# EAGLE schematic tester (EAGLE 7.5.0)

## Sheet 1 of 3: BUS
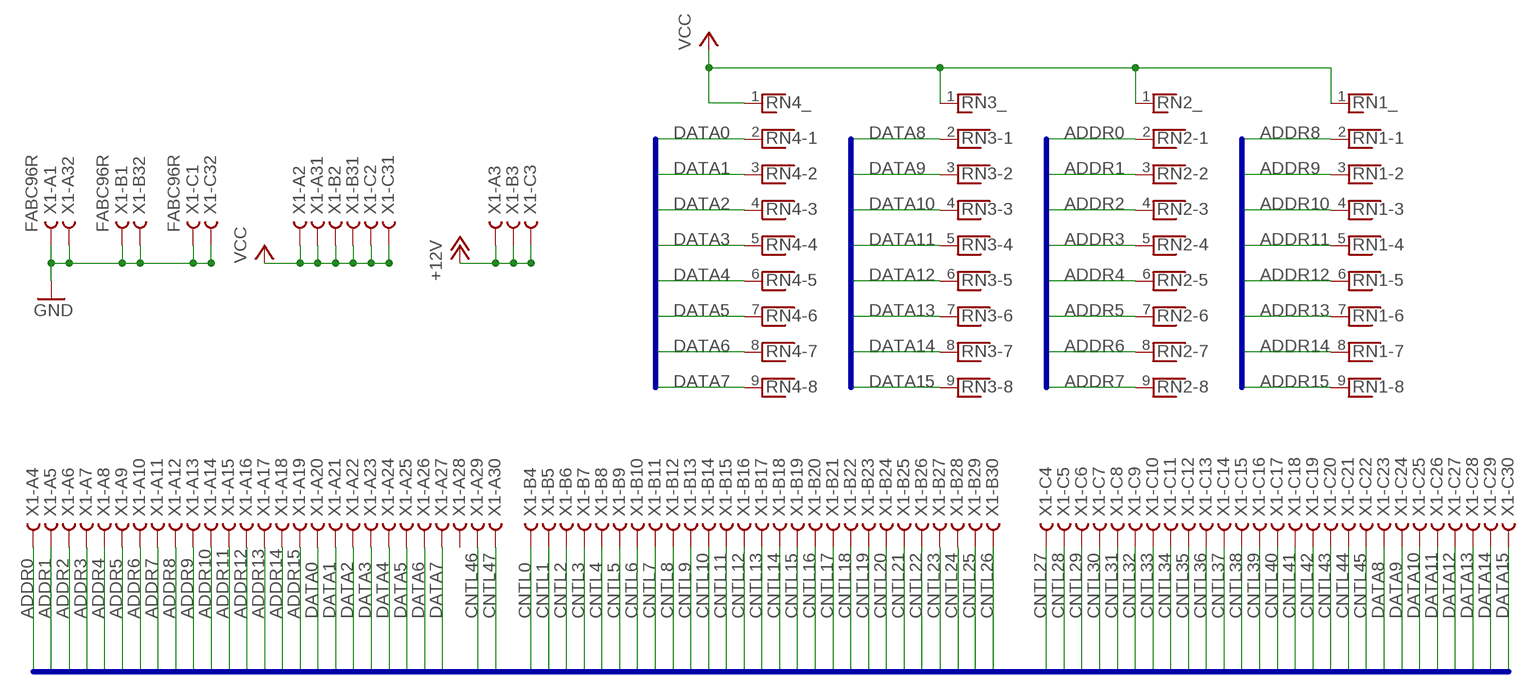
[diagram p0: schematic, sheet 1]

### Parts
RN1  RNX8  [RN-9]
RN2  RNX8  [RN-9]
RN3  RNX8  [RN-9]
RN4  RNX8  [RN-9]
X1  FABC96R  [FABC96R]

### Nets
+12V: X1.A3 X1.B3 X1.C3
ADDR0: RN2.2 X1.A4 ; also sheet 2
ADDR1: RN2.3 X1.A5 ; also sheet 2
ADDR2: RN2.4 X1.A6 ; also sheet 2
ADDR3: RN2.5 X1.A7 ; also sheet 2
ADDR4: RN2.6 X1.A8 ; also sheet 2
ADDR5: RN2.7 X1.A9 ; also sheet 2
ADDR6: RN2.8 X1.A10 ; also sheet 2
ADDR7: RN2.9 X1.A11 ; also sheet 2
ADDR8: RN1.2 X1.A12 ; also sheet 2
ADDR9: RN1.3 X1.A13 ; also sheet 2
ADDR10: RN1.4 X1.A14 ; also sheet 2
ADDR11: RN1.5 X1.A15 ; also sheet 2
ADDR12: RN1.6 X1.A16 ; also sheet 2
ADDR13: RN1.7 X1.A17 ; also sheet 2
ADDR14: RN1.8 X1.A18 ; also sheet 2
ADDR15: RN1.9 X1.A19 ; also sheet 2
CNTL0: X1.B4 ; also sheet 2
CNTL1: X1.B5 ; also sheet 2
CNTL2: X1.B6 ; also sheet 2
CNTL3: X1.B7 ; also sheet 2
CNTL4: X1.B8 ; also sheet 2
CNTL5: X1.B9 ; also sheet 2
CNTL6: X1.B10 ; also sheet 2
CNTL7: X1.B11 ; also sheet 2
CNTL8: X1.B12 ; also sheet 2
CNTL9: X1.B13 ; also sheet 2
CNTL10: X1.B14 ; also sheet 2
CNTL11: X1.B15 ; also sheet 2
CNTL12: X1.B16 ; also sheet 2
CNTL13: X1.B17 ; also sheet 2
CNTL14: X1.B18 ; also sheet 2
CNTL15: X1.B19 ; also sheet 2
CNTL16: X1.B20 ; also sheet 2
CNTL17: X1.B21 ; also sheet 2
CNTL18: X1.B22 ; also sheet 2
CNTL19: X1.B23 ; also sheet 2
CNTL20: X1.B24 ; also sheet 2
CNTL21: X1.B25 ; also sheet 2
CNTL22: X1.B26 ; also sheet 2
CNTL23: X1.B27 ; also sheet 2
CNTL24: X1.B28 ; also sheet 2
CNTL25: X1.B29 ; also sheet 2
CNTL26: X1.B30 ; also sheet 2
CNTL27: X1.C4 ; also sheet 2
CNTL28: X1.C5 ; also sheet 2
CNTL29: X1.C6 ; also sheet 2
CNTL30: X1.C7 ; also sheet 2
CNTL31: X1.C8 ; also sheet 2
CNTL32: X1.C9 ; also sheet 2
CNTL33: X1.C10 ; also sheet 2
CNTL34: X1.C11 ; also sheet 2
CNTL35: X1.C12 ; also sheet 2
CNTL36: X1.C13 ; also sheet 2
CNTL37: X1.C14 ; also sheet 2
CNTL38: X1.C15 ; also sheet 2
CNTL39: X1.C16 ; also sheet 2
CNTL40: X1.C17 ; also sheet 2
CNTL41: X1.C18 ; also sheet 2
CNTL42: X1.C19 ; also sheet 2
CNTL43: X1.C20 ; also sheet 2
CNTL44: X1.C21 ; also sheet 2
CNTL45: X1.C22 ; also sheet 2
CNTL46: X1.A29 ; also sheet 2
CNTL47: X1.A30 ; also sheet 2
DATA0: RN4.2 X1.A20 ; also sheet 2
DATA1: RN4.3 X1.A21 ; also sheet 2
DATA2: RN4.4 X1.A22 ; also sheet 2
DATA3: RN4.5 X1.A23 ; also sheet 2
DATA4: RN4.6 X1.A24 ; also sheet 2
DATA5: RN4.7 X1.A25 ; also sheet 2
DATA6: RN4.8 X1.A26 ; also sheet 2
DATA7: RN4.9 X1.A27 ; also sheet 2
DATA8: RN3.2 X1.C23 ; also sheet 2
DATA9: RN3.3 X1.C24 ; also sheet 2
DATA10: RN3.4 X1.C25 ; also sheet 2
DATA11: RN3.5 X1.C26 ; also sheet 2
DATA12: RN3.6 X1.C27 ; also sheet 2
DATA13: RN3.7 X1.C28 ; also sheet 2
DATA14: RN3.8 X1.C29 ; also sheet 2
DATA15: RN3.9 X1.C30 ; also sheet 2
GND: X1.A1 X1.A32 X1.B1 X1.B32 X1.C1 X1.C32 ; also sheet 2,3
VCC: RN1.1 RN2.1 RN3.1 RN4.1 X1.A2 X1.A31 X1.B2 X1.B31 X1.C2 X1.C31 ; also sheet 2,3
Unconnected: X1.A28

### Buses
ADDR[0..15],DATA[0..15],CNTL[0..48]

## Sheet 2 of 3: I/O
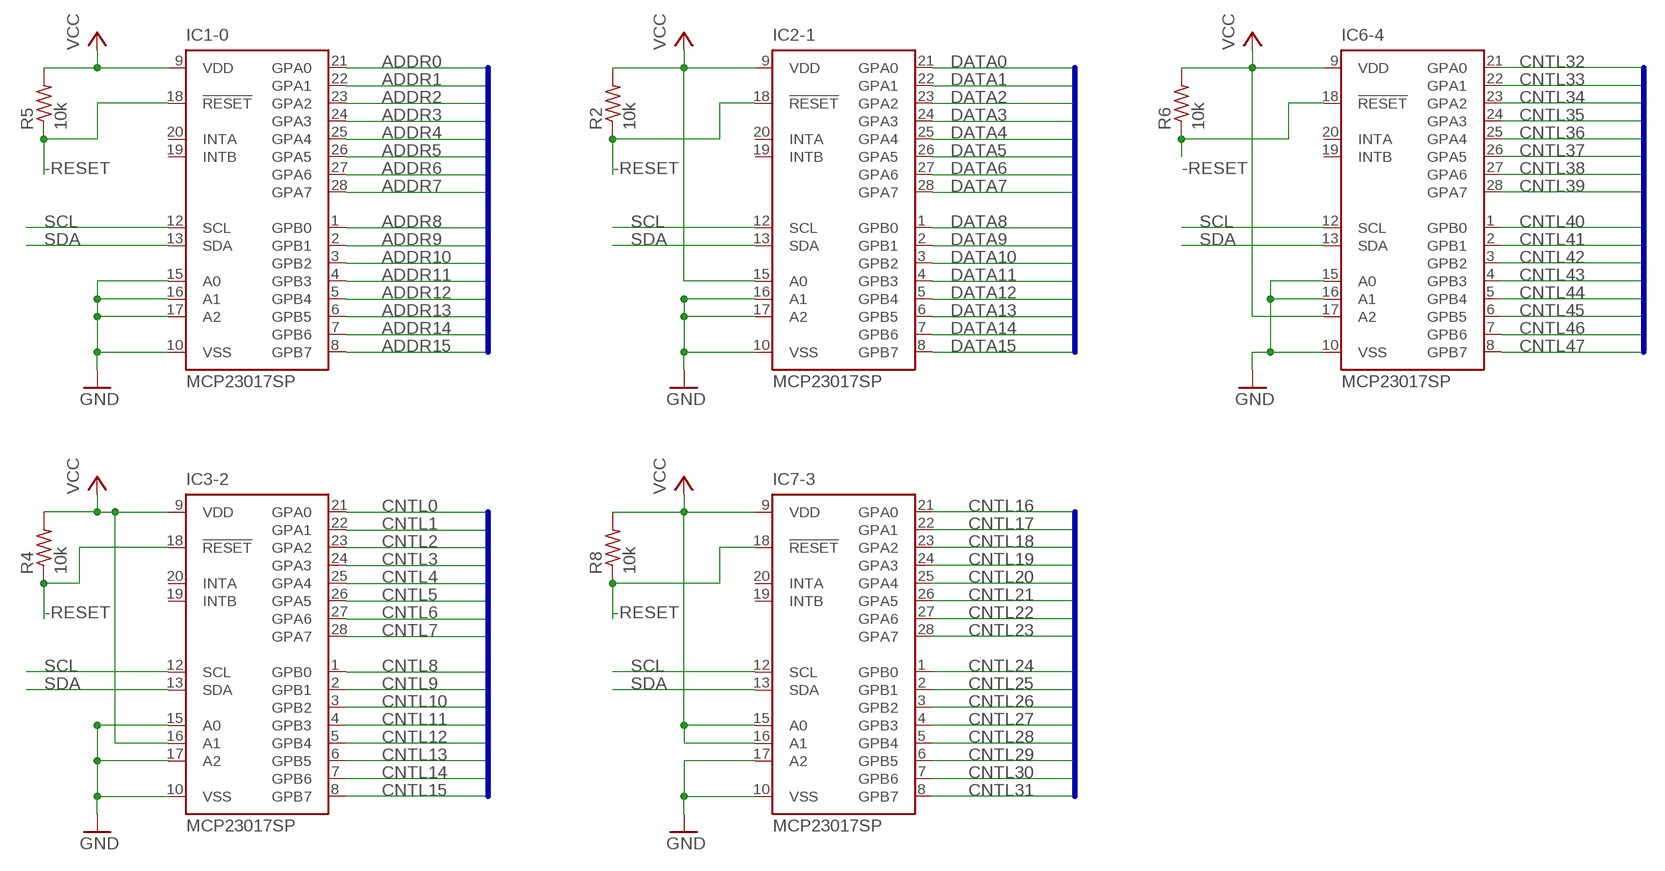
[diagram p1: schematic, sheet 2]

### Parts
IC1-0  MCP23017SP  [DIL28-3]
IC2-1  MCP23017SP  [DIL28-3]
IC3-2  MCP23017SP  [DIL28-3]
IC6-4  MCP23017SP  [DIL28-3]
IC7-3  MCP23017SP  [DIL28-3]
R2  10k  R-US_0207/10  [0207/10]
R4  10k  R-US_0207/10  [0207/10]
R5  10k  R-US_0207/10  [0207/10]
R6  10k  R-US_0207/10  [0207/10]
R8  10k  R-US_0207/10  [0207/10]

### Nets
-RESET: IC1-0.18(!RESET) IC2-1.18(!RESET) IC3-2.18(!RESET) IC6-4.18(!RESET) IC7-3.18(!RESET) R2.1 R4.1 R5.1 R6.1 R8.1 ; also sheet 3
ADDR0: IC1-0.21(GPA0) ; also sheet 1
ADDR1: IC1-0.22(GPA1) ; also sheet 1
ADDR2: IC1-0.23(GPA2) ; also sheet 1
ADDR3: IC1-0.24(GPA3) ; also sheet 1
ADDR4: IC1-0.25(GPA4) ; also sheet 1
ADDR5: IC1-0.26(GPA5) ; also sheet 1
ADDR6: IC1-0.27(GPA6) ; also sheet 1
ADDR7: IC1-0.28(GPA7) ; also sheet 1
ADDR8: IC1-0.1(GPB0) ; also sheet 1
ADDR9: IC1-0.2(GPB1) ; also sheet 1
ADDR10: IC1-0.3(GPB2) ; also sheet 1
ADDR11: IC1-0.4(GPB3) ; also sheet 1
ADDR12: IC1-0.5(GPB4) ; also sheet 1
ADDR13: IC1-0.6(GPB5) ; also sheet 1
ADDR14: IC1-0.7(GPB6) ; also sheet 1
ADDR15: IC1-0.8(GPB7) ; also sheet 1
CNTL0: IC3-2.21(GPA0) ; also sheet 1
CNTL1: IC3-2.22(GPA1) ; also sheet 1
CNTL2: IC3-2.23(GPA2) ; also sheet 1
CNTL3: IC3-2.24(GPA3) ; also sheet 1
CNTL4: IC3-2.25(GPA4) ; also sheet 1
CNTL5: IC3-2.26(GPA5) ; also sheet 1
CNTL6: IC3-2.27(GPA6) ; also sheet 1
CNTL7: IC3-2.28(GPA7) ; also sheet 1
CNTL8: IC3-2.1(GPB0) ; also sheet 1
CNTL9: IC3-2.2(GPB1) ; also sheet 1
CNTL10: IC3-2.3(GPB2) ; also sheet 1
CNTL11: IC3-2.4(GPB3) ; also sheet 1
CNTL12: IC3-2.5(GPB4) ; also sheet 1
CNTL13: IC3-2.6(GPB5) ; also sheet 1
CNTL14: IC3-2.7(GPB6) ; also sheet 1
CNTL15: IC3-2.8(GPB7) ; also sheet 1
CNTL16: IC7-3.21(GPA0) ; also sheet 1
CNTL17: IC7-3.22(GPA1) ; also sheet 1
CNTL18: IC7-3.23(GPA2) ; also sheet 1
CNTL19: IC7-3.24(GPA3) ; also sheet 1
CNTL20: IC7-3.25(GPA4) ; also sheet 1
CNTL21: IC7-3.26(GPA5) ; also sheet 1
CNTL22: IC7-3.27(GPA6) ; also sheet 1
CNTL23: IC7-3.28(GPA7) ; also sheet 1
CNTL24: IC7-3.1(GPB0) ; also sheet 1
CNTL25: IC7-3.2(GPB1) ; also sheet 1
CNTL26: IC7-3.3(GPB2) ; also sheet 1
CNTL27: IC7-3.4(GPB3) ; also sheet 1
CNTL28: IC7-3.5(GPB4) ; also sheet 1
CNTL29: IC7-3.6(GPB5) ; also sheet 1
CNTL30: IC7-3.7(GPB6) ; also sheet 1
CNTL31: IC7-3.8(GPB7) ; also sheet 1
CNTL32: IC6-4.21(GPA0) ; also sheet 1
CNTL33: IC6-4.22(GPA1) ; also sheet 1
CNTL34: IC6-4.23(GPA2) ; also sheet 1
CNTL35: IC6-4.24(GPA3) ; also sheet 1
CNTL36: IC6-4.25(GPA4) ; also sheet 1
CNTL37: IC6-4.26(GPA5) ; also sheet 1
CNTL38: IC6-4.27(GPA6) ; also sheet 1
CNTL39: IC6-4.28(GPA7) ; also sheet 1
CNTL40: IC6-4.1(GPB0) ; also sheet 1
CNTL41: IC6-4.2(GPB1) ; also sheet 1
CNTL42: IC6-4.3(GPB2) ; also sheet 1
CNTL43: IC6-4.4(GPB3) ; also sheet 1
CNTL44: IC6-4.5(GPB4) ; also sheet 1
CNTL45: IC6-4.6(GPB5) ; also sheet 1
CNTL46: IC6-4.7(GPB6) ; also sheet 1
CNTL47: IC6-4.8(GPB7) ; also sheet 1
DATA0: IC2-1.21(GPA0) ; also sheet 1
DATA1: IC2-1.22(GPA1) ; also sheet 1
DATA2: IC2-1.23(GPA2) ; also sheet 1
DATA3: IC2-1.24(GPA3) ; also sheet 1
DATA4: IC2-1.25(GPA4) ; also sheet 1
DATA5: IC2-1.26(GPA5) ; also sheet 1
DATA6: IC2-1.27(GPA6) ; also sheet 1
DATA7: IC2-1.28(GPA7) ; also sheet 1
DATA8: IC2-1.1(GPB0) ; also sheet 1
DATA9: IC2-1.2(GPB1) ; also sheet 1
DATA10: IC2-1.3(GPB2) ; also sheet 1
DATA11: IC2-1.4(GPB3) ; also sheet 1
DATA12: IC2-1.5(GPB4) ; also sheet 1
DATA13: IC2-1.6(GPB5) ; also sheet 1
DATA14: IC2-1.7(GPB6) ; also sheet 1
DATA15: IC2-1.8(GPB7) ; also sheet 1
GND: IC1-0.10(VSS) IC1-0.15(A0) IC1-0.16(A1) IC1-0.17(A2) IC2-1.10(VSS) IC2-1.16(A1) IC2-1.17(A2) IC3-2.10(VSS) IC3-2.15(A0) IC3-2.17(A2) IC6-4.10(VSS) IC6-4.15(A0) IC6-4.16(A1) IC7-3.10(VSS) IC7-3.17(A2) ; also sheet 1,3
SCL: IC1-0.12(SCL) IC2-1.12(SCL) IC3-2.12(SCL) IC6-4.12(SCL) IC7-3.12(SCL) ; also sheet 3
SDA: IC1-0.13(SDA) IC2-1.13(SDA) IC3-2.13(SDA) IC6-4.13(SDA) IC7-3.13(SDA) ; also sheet 3
VCC: IC1-0.9(VDD) IC2-1.9(VDD) IC2-1.15(A0) IC3-2.9(VDD) IC3-2.16(A1) IC6-4.9(VDD) IC6-4.17(A2) IC7-3.9(VDD) IC7-3.15(A0) IC7-3.16(A1) R2.2 R4.2 R5.2 R6.2 R8.2 ; also sheet 1,3
Unconnected: IC1-0.19(INTB) IC1-0.20(INTA) IC2-1.19(INTB) IC2-1.20(INTA) IC3-2.19(INTB) IC3-2.20(INTA) IC6-4.19(INTB) IC6-4.20(INTA) IC7-3.19(INTB) IC7-3.20(INTA)

### Buses
ADDR[0..15]
DATA[0..15]
CNTL[0..53]

## Sheet 3 of 3: CPU
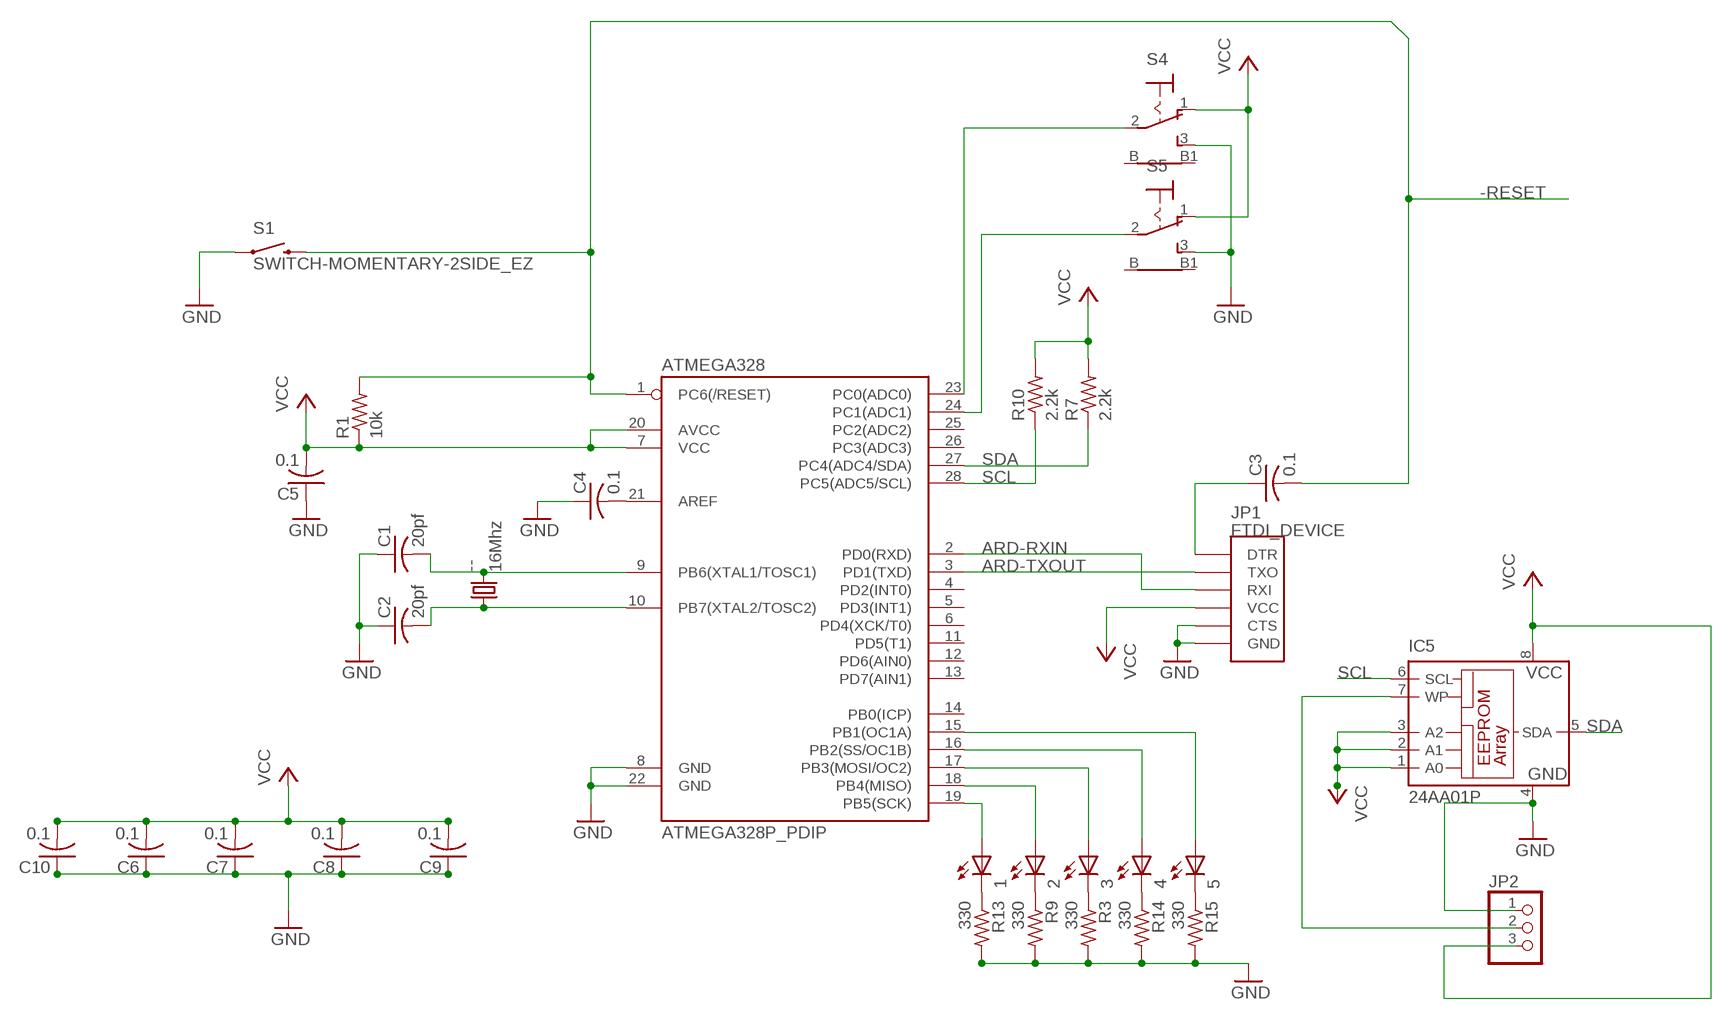
[diagram p2: schematic, sheet 3]

### Parts
1  LED5MM  [LED5MM]
2  LED5MM  [LED5MM]
3  LED5MM  [LED5MM]
4  LED5MM  [LED5MM]
5  LED5MM  [LED5MM]
--  16Mhz  CRYSTALHC49S  [HC49/S]
ATMEGA328  ATMEGA328P_PDIP  [DIL28-3]
C1  20pf  C-US025-024X044  [C025-024X044]
C2  20pf  C-US025-024X044  [C025-024X044]
C3  0.1  C-US025-024X044  [C025-024X044]
C4  0.1  C-US025-024X044  [C025-024X044]
C5  0.1  C-US025-024X044  [C025-024X044]
C6  0.1  C-US025-024X044  [C025-024X044]
C7  0.1  C-US025-024X044  [C025-024X044]
C8  0.1  C-US025-024X044  [C025-024X044]
C9  0.1  C-US025-024X044  [C025-024X044]
C10  0.1  C-US025-024X044  [C025-024X044]
IC5  24AA01P  [DIL8]
JP1  FTDI_DEVICE  [FTDI_DEVICE_SIDE]
JP2  PINHD-1X3  [1X03]
R1  10k  R-US_0207/10  [0207/10]
R3  330  R-US_0207/10  [0207/10]
R7  2.2k  R-US_0207/10  [0207/10]
R9  330  R-US_0207/10  [0207/10]
R10  2.2k  R-US_0207/10  [0207/10]
R13  330  R-US_0207/10  [0207/10]
R14  330  R-US_0207/10  [0207/10]
R15  330  R-US_0207/10  [0207/10]
S1  SWITCH-MOMENTARY-2SIDE_EZ  [TACTILE-PTH-SIDEEZ]
S4  9070-1W  [9070-1W]
S5  9070-1W  [9070-1W]

### Nets
-RESET: ATMEGA328.1(PC6(/RESET)) C3.2 R1.2 S1.2 ; also sheet 2
ARD-RXIN: ATMEGA328.2(PD0(RXD)) JP1.P$3(RXI)
ARD-TXOUT: ATMEGA328.3(PD1(TXD)) JP1.P$2(TXO)
GND: ATMEGA328.8(GND) ATMEGA328.22(GND) C1.1 C2.1 C4.1 C5.1 C6.1 C7.1 C8.1 C9.1 C10.1 IC5.4(GND) JP1.P$5(CTS) JP1.P$6(GND) JP2.1 R3.2 R9.2 R13.2 R14.2 R15.2 S1.1 S4.3(S) S5.3(S) ; also sheet 1,2
N$1: 1.A ATMEGA328.19(PB5(SCK))
N$2: IC5.7(WP) JP2.2
N$3: --.2 ATMEGA328.9(PB6(XTAL1/TOSC1)) C1.2
N$4: --.1 ATMEGA328.10(PB7(XTAL2/TOSC2)) C2.2
N$6: 2.A ATMEGA328.18(PB4(MISO))
N$7: 3.A ATMEGA328.17(PB3(MOSI/OC2))
N$8: 4.A ATMEGA328.16(PB2(SS/OC1B))
N$9: C3.1 JP1.P$1(DTR)
N$10: 5.A ATMEGA328.15(PB1(OC1A))
N$11: 2.K(C) R9.1
N$12: 1.K(C) R13.1
N$13: 3.K(C) R3.1
N$14: ATMEGA328.21(AREF) C4.2
N$15: 4.K(C) R14.1
N$16: 5.K(C) R15.1
N$18: ATMEGA328.23(PC0(ADC0)) S4.2(P)
N$19: ATMEGA328.24(PC1(ADC1)) S5.2(P)
SCL: ATMEGA328.28(PC5(ADC5/SCL)) IC5.6(SCL) R10.1 ; also sheet 2
SDA: ATMEGA328.27(PC4(ADC4/SDA)) IC5.5(SDA) R7.1 ; also sheet 2
VCC: ATMEGA328.7(VCC) ATMEGA328.20(AVCC) C5.2 C6.2 C7.2 C8.2 C9.2 C10.2 IC5.1(A0) IC5.2(A1) IC5.3(A2) IC5.8(VCC) JP1.P$4(VCC) JP2.3 R1.1 R7.2 R10.2 S4.1(O) S5.1(O) ; also sheet 1,2
Unconnected: ATMEGA328.4(PD2(INT0)) ATMEGA328.5(PD3(INT1)) ATMEGA328.6(PD4(XCK/T0)) ATMEGA328.11(PD5(T1)) ATMEGA328.12(PD6(AIN0)) ATMEGA328.13(PD7(AIN1)) ATMEGA328.14(PB0(ICP)) ATMEGA328.25(PC2(ADC2)) ATMEGA328.26(PC3(ADC3)) S4.B S4.B1 S5.B S5.B1

## Library data of the parts
1-5 = led:LED: LED OSRAM: - CHIPLED LG R971, LG N971, LY N971, LG Q971, LY Q971, LO R971, LY R971 LH N974, LH R974 LS Q976, LO Q976, LY Q976 LO Q996 - Hyper CHIPLED LW Q18S LB Q993, LB Q99A, LB R99A - SideLED LS A670, LO A670, LY A670, LG A670, LP A670 LB A673, LV A673, LT A673, LW A673 LH A674 LY A675 LS A676, LA A676, LO A676, LY A676, LW A676 LS A679, LY A679, LG A679 - Hyper Micro SIDELED® LS Y876, LA Y876, LO Y876, LY Y876 LT Y87S - SmartLED LW L88C, LW L88S LB L89C, LB L89S, LG L890 LS L89K, LO L89K, LY L89K LS L896, LA L896, LO L896, LY L896 - TOPLED LS T670, LO T670, LY T670, LG T670, LP T670 LSG T670, LSP T670, LSY T670, LOP T670, LYG T670 LG T671, LOG T671, LSG T671 LB T673, LV T673, LT T673, LW T673 LH T674 LS T676, LA T676, LO T676, LY T676, LB T676, LH T676, LSB T676, LW T676 LB T67C, LV T67C, LT T67C, LS T67K, LO T67K, LY T67K, LW E67C LS E67B, LA E67B, LO E67B, LY E67B, LB E67C, LV E67C, LT E67C LW T67C LS T679, LY T679, LG T679 LS T770, LO T770, LY T770, LG T770, LP T770 LB T773, LV T773, LT T773, LW T773 LH T774 LS E675, LA E675, LY E675, LS T675 LS T776, LA T776, LO T776, LY T776, LB T776 LHGB T686 LT T68C, LB T68C - Hyper Mini TOPLED® LB M676 - Mini TOPLED Santana® LG M470 LS M47K, LO M47K, LY M47K Source: http://www.osram.convergy.de LUXEON: - LUMILED® LXK2-PW12-R00, LXK2-PW12-S00, LXK2-PW14-U00, LXK2-PW14-V00 LXK2-PM12-R00, LXK2-PM12-S00, LXK2-PM14-U00 LXK2-PE12-Q00, LXK2-PE12-R00, LXK2-PE12-S00, LXK2-PE14-T00, LXK2-PE14-U00 LXK2-PB12-K00, LXK2-PB12-L00, LXK2-PB12-M00, LXK2-PB14-N00, LXK2-PB14-P00, LXK2-PB14-Q00 LXK2-PR12-L00, LXK2-PR12-M00, LXK2-PR14-Q00, LXK2-PR14-R00 LXK2-PD12-Q00, LXK2-PD12-R00, LXK2-PD12-S00 LXK2-PH12-R00, LXK2-PH12-S00 LXK2-PL12-P00, LXK2-PL12-Q00, LXK2-PL12-R00 Source: www.luxeon.com KINGBRIGHT: KA-3528ASYC Source: www.kingbright.com
-- = crystal:CRYSTAL: CRYSTAL; OC_FARNELL: 1667008; OC_NEWARK: unknown
ATMEGA328 = SparkFun-DigitalIC:ATMEGA328P_PDIP: uC used in the Arduino 32kb flash, 1k EEPROM, 2k SRAM This is the through-hole version of this chip.
C1-C10 = adafruit:C-US: CAPACITOR, American symbol
IC1-0 IC2-1 IC3-2 IC6-4 IC7-3 = microchip:MCP23017: http://ww1.microchip.com/downloads/en/DeviceDoc/21952a.pdf Source: http://ww1.microchip.com/downloads/en/DeviceDoc/21952a.pdf; MF: MICROCHIP; MPN: MCP23017-E/SP; OC_FARNELL: 1332088; OC_NEWARK: 31K2959
IC5 = microchip:24*: Serial EEPROM I2C; MPN: 24AA01-I/P; OC_FARNELL: 1331266; OC_NEWARK: 35M0692
JP1 = SparkFun-Connectors:FTDI_DEVICE: Connector which mates to FTDI basic or FTDI cable.
JP2 = pinhead:PINHD-1X3: PIN HEADER
R1 R3 R7 R9 R10 R13-R15 = resistor:R-US_: RESISTOR, American symbol
R2 R4-R6 R8 = adafruit:R-US_: RESISTOR, American symbol
RN1-RN4 = resistor-net:RNX8: RESISTOR NETWORK; OC_FARNELL: unknown; OC_NEWARK: unknown
S1 = SparkFun-Electromechanical:SWITCH-MOMENTARY-2: Various NO switches- pushbuttons, reed, etc
S4 S5 = switch:9070-1W: TOGGLE SWITCH Marquardt
X1 = con-vg:FABC96R: CONNECTOR female, 96 pins, type R, rows ABC, grid 2.54 mm